# EasyEDA Pro project MP3426正负电源.eprj

# Schematic Schematic1
Board Name: Board1; Create Date: 2024-08-05; Page Name: P1; Project Name: MP3426正负电源; Schematic Name: Schematic1; Update Date: 2024-10-08; Company: 嘉立创EDA; Page Size: A4; Version: V1.0
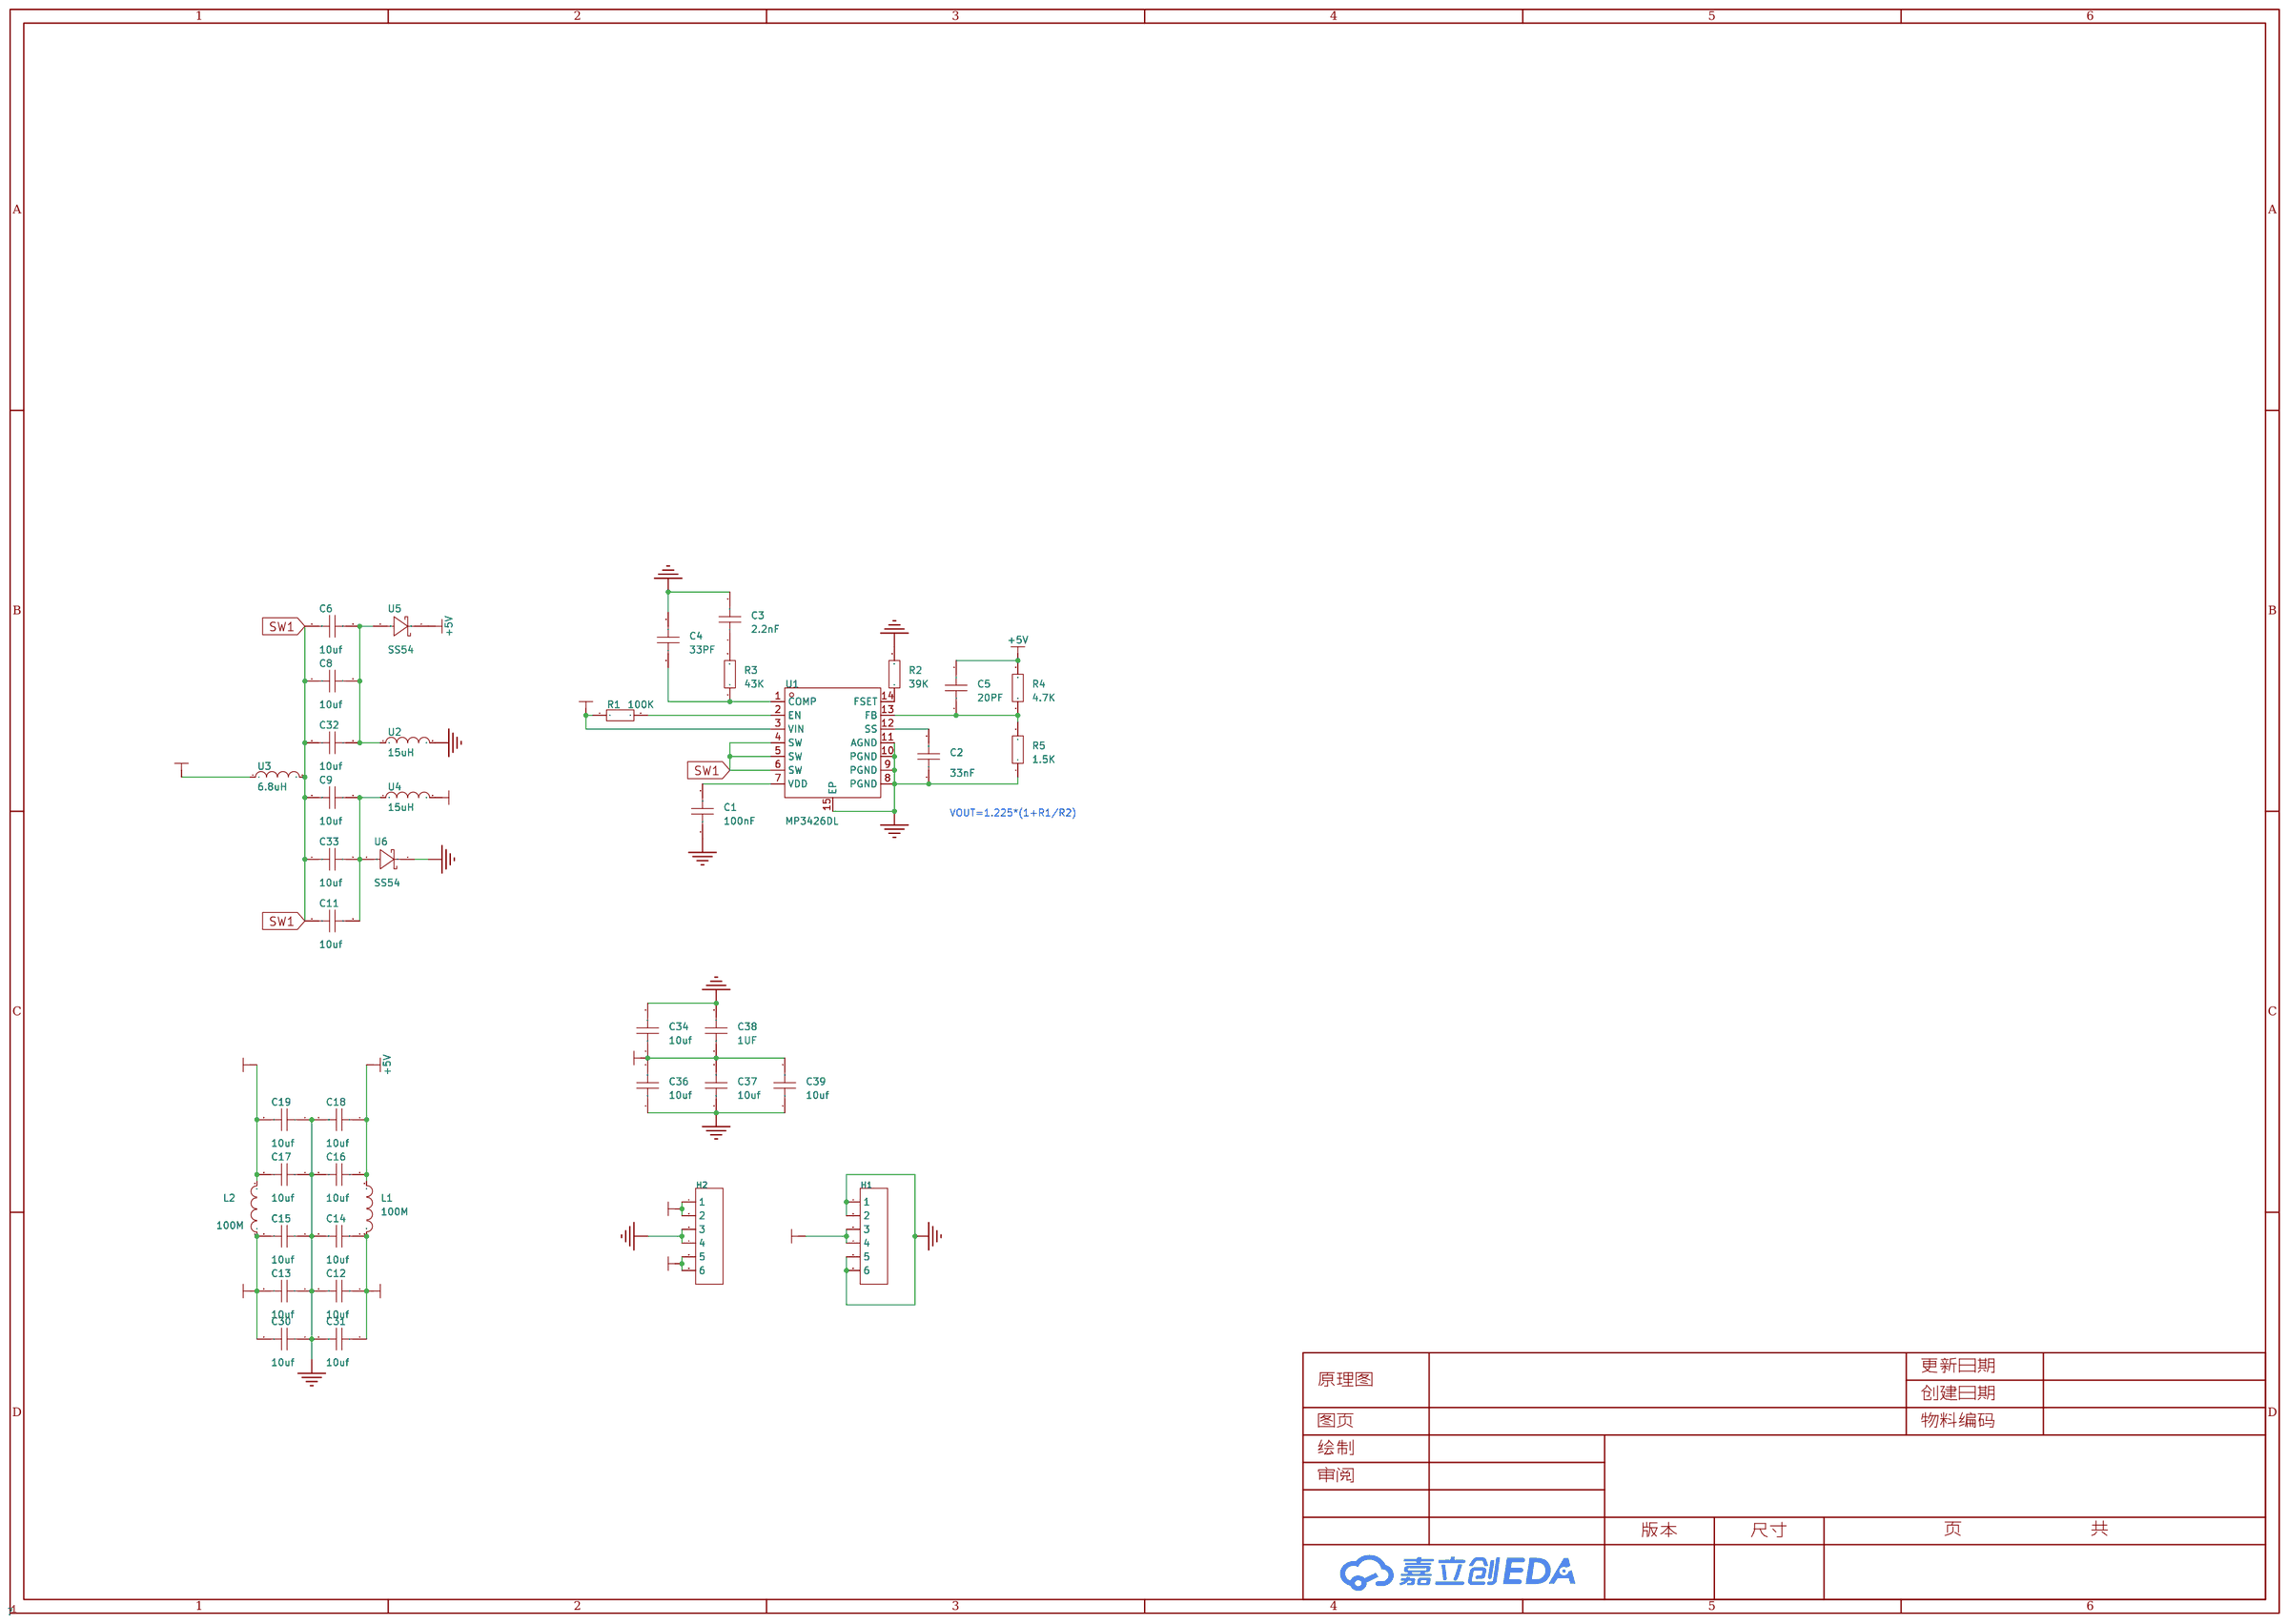
[diagram p0: schematic sheet]

## Parts
C1  100nF  [C0603]
C2  33nF  [C0603]
C3  2.2nF  [C0603]
C4  33PF  [C0603]
C5  20PF  [C0603]
C6  10uf  [C1206]
C8  10uf  [C1206]
C9  10uf  [C1206]
C11  10uf  [C1206]
C12  10uf  [C1206]
C13  10uf  [C1206]
C14  10uf  [C1206]
C15  10uf  [C1206]
C16  10uf  [C1206]
C17  10uf  [C1206]
C18  10uf  [C1206]
C19  10uf  [C1206]
C30  10uf  [C1206]
C31  10uf  [C1206]
C32  10uf  [C1206]
C33  10uf  [C1206]
C34  10uf  [C1206]
C36  10uf  [C1206]
C37  10uf  [C1206]
C38  1UF  [C0603]
C39  10uf  [C1206]
H1  -  [HDR-TH_6P-P2.54-V-M-1]
H2  -  [HDR-TH_6P-P2.54-V-M-1]
L1  100M  [L1206]
L2  100M  [L1206]
R1  100K  [R0603]
R2  39K  [R0603]
R3  43K  [R0603]
R4  4.7K  [R0603]
R5  1.5K  [R0603]
U1  MP3426DL  [DFN-14_L4.0-W3.0-P0.50-BL-EP]
U2  15uH  [IND-SMD_L7.1-W6.6-1]
U3  6.8uH  [IND-SMD_L11.0-W10.2]
U4  15uH  [IND-SMD_L7.1-W6.6-1]
U5  SS54  [SMB_L4.3-W3.6-LS5.4-RD]
U6  SS54  [SMB_L4.3-W3.6-LS5.4-RD]

## Library data of the parts
C1-C5 C38 = CAP_0603: Supplier Footprint: 0603
C6 C8 C9 C11-C19 C30-C34 C36 C37 C39 = CAP_1206: Supplier Footprint: 1206
H1 H2 = HDR-M_2.54_1x6P: Supplier Part: C37208; Supplier Footprint: 插件
L1 L2 = L_1206
R1-R5 = Res_0603: Supplier Footprint: 0603
U1 = MP3426DL: Supplier Part: C2909511; Supplier Footprint: QFN-14(3x4x0.5); JLCPCB Part Class: 扩展库; Supplier: LCSC
U2 U4 = CXP0650-4R7M-AG(4.7uh): 电感值:4.7uH;精度:±20%;额定电流:6A;饱和电流(Isat):8A;类型:一体成型电感;; LCSC Part Name: 4.7uH ±20% 8A; Supplier Part: C7461369; Manufacturer: DMBJ(振宝佳); Supplier Footprint: 0650; Datasheet: https://atta.szlcsc.com/upload/public/pdf/source/20230706/7F3A5B39C5AD80A91C9FA782B54A296B.pdf; Supplier: LCSC; Tolerance: ±20%; Rated Current: 6A; Saturation Current (Isat): 8A; DC Resistance (DCR): 34mΩ; Type: 一体成型电感
U3 = CXP1050-220M-AG(22uh): 电感值:22uH;精度:±20%;额定电流:5.5A;饱和电流(Isat):8A;类型:一体成型电感;; LCSC Part Name: 22uH ±20% 8A; Supplier Part: C7461393; Manufacturer: DMBJ(振宝佳); Supplier Footprint: 1050; JLCPCB Part Class: 扩展库; Datasheet: https://atta.szlcsc.com/upload/public/pdf/source/20230706/7F3A5B39C5AD80A91C9FA782B54A296B.pdf; Supplier: LCSC; Tolerance: ±20%; Rated Current: 5.5A; Saturation Current (Isat): 8A; DC Resistance (DCR): 48mΩ; Type: 一体成型电感
U5 U6 = SS54_C5200096: LCSC Part Name: IF:5A VR:40V VF:0.55V IFSM:150A; Supplier Part: C5200096; Manufacturer: HXY MOSFET(华轩阳电子); Supplier Footprint: SMB; JLCPCB Part Class: 扩展库; Datasheet: https://item.szlcsc.com/datasheet/SS54/5888311.html; Supplier: LCSC; Diode Configuration: 独立式; Voltage - Forward(Vf@If): 550mV@5A; Voltage - DC Reverse(Vr): 40V; Current - Rectified: 5A; Reverse Leakage Current (Ir): 500uA; Operating Junction Temperature Range: -55℃~+125℃; Non-Repetitive Peak Forward Surge Current: 150A

## Nets
+5V: C5.2 C16.1 C18.1 L1.1 R4.2 U5.1
+5VO: C12.1 C14.1 C31.1 H2.1 H2.2 L1.2
-5V: C17.2 C19.2 L2.2 U4.2
-5VO: C13.2 C15.2 C30.2 H2.5 H2.6 L2.1
GND: C1.1 C2.1 C3.2 C4.2 C12.2 C13.1 C14.2 C15.1 C16.2 C17.1 C18.2 C19.1 C30.1 C31.2 C34.2 C36.1 C37.1 C38.2 C39.1 H1.1 H1.2 H1.5 H1.6 H2.3 H2.4 R2.2 R5.1 U1.8(PGND) U1.9(PGND) U1.10(PGND) U1.11(AGND) U1.15(EP) U2.2 U6.1
VIN: C34.1 C36.2 C37.2 C38.1 C39.2 H1.3 H1.4 R1.1 U1.3(VIN) U3.1
SW1: C6.1 C8.1 C9.1 C11.1 C32.1 C33.1 U1.4(SW) U1.5(SW) U1.6(SW) U3.2
$1N199: R1.2 U1.2(EN)
$1N309: C1.2 U1.7(VDD)
$1N386: R2.1 U1.14(FSET)
$1N504: C2.2 U1.12(SS)
$1N559: C3.1 R3.2
$1N619: C4.1 R3.1 U1.1(COMP)
$1N703: C5.1 R4.1 R5.2 U1.13(FB)
$1N1052: C9.2 C11.2 C33.2 U4.1 U6.2
$1N1057: C6.2 C8.2 C32.2 U2.1 U5.2

## Notes on the sheet
- VOUT=1.225*(1+R1/R2)

# Board PCB1
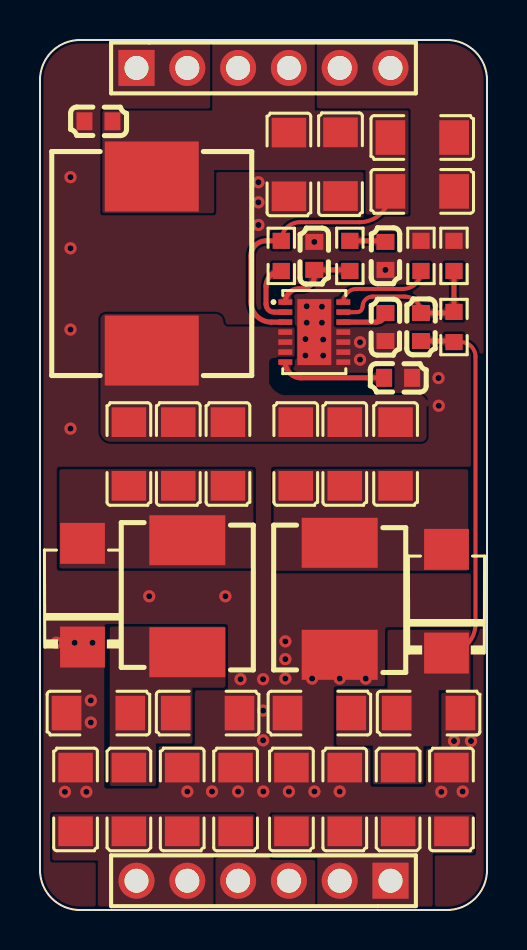
[diagram p1: board, top side]
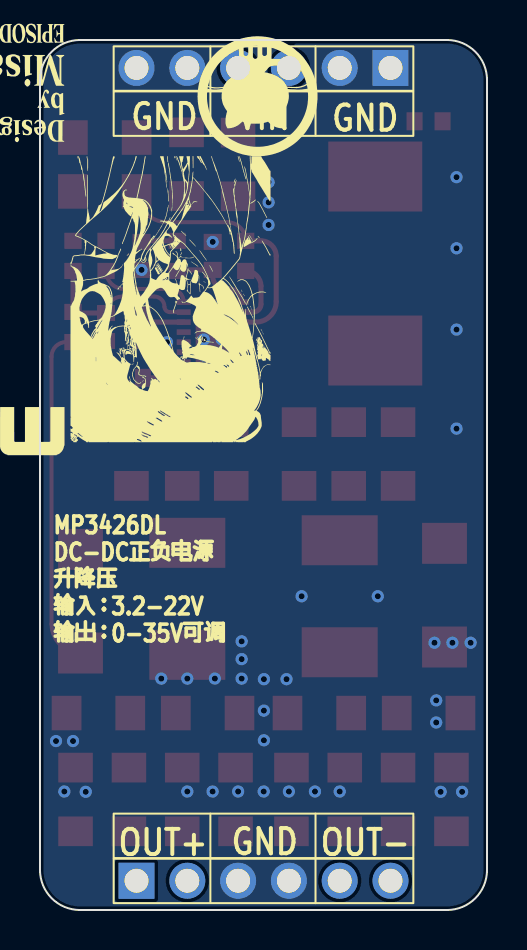
[diagram p2: board, bottom side, seen from below]

Outline 22.35 x 43.5 mm; copper layers: Top Layer, Bottom Layer. Coordinates in mm from the lower left corner of the outline.
Outline path: 0,41.5 0,2 arc(0.59,0.59) 2,0 20.35,0 arc(21.77,0.59) 22.35,2 22.35,41.5 arc(21.77,42.91) 20.35,43.5 2,43.5 arc(0.59,42.91) 0,41.5
Stack: Top Layer 0.035mm / Dielectric1 1.51mm FR4 er 4.5 / Bottom Layer 0.035mm

## Design rules (mm)
template: 自定义配置
spacing copperThickness1oz (default): track to track 0.102, other pairs 0.152 to 0.3
spacing copperThickness2oz: track to track 0.203, other pairs 0.152 to 0.3
track width copperThickness1oz (default): min 0.127, default 0.254, max 2.54
track width copperThickness2oz: min 0.203, default 0.254, max 2.54
differential pair differentialPair (default): width min 0.127, default 0.254, max 2.54; gap min 0.152, default 0.152
via viaSize (default): diameter min 0.5, default 0.61, max 10; hole min 0.3, default 0.305, max 6.3

## Placement (name value [footprint] x y rotation side)
C1  100nF  [C0603]  17.91 26.61 180 top
C2  33nF  [C0603]  17.27 29.15 90 top
C3  2.2nF  [C0603]  17.27 32.7 270 top
C4  33PF  [C0603]  13.72 32.7 90 top
C5  20PF  [C0603]  19.05 29.15 270 top
C6  10uf  [C1206]  15.24 22.8 270 top
C8  10uf  [C1206]  12.79 22.8 270 top
C9  10uf  [C1206]  6.92 22.8 270 top
C11  10uf  [C1206]  4.44 22.8 270 top
C12  10uf  [C1206]  15.24 5.53 90 top
C13  10uf  [C1206]  1.78 5.53 270 top
C14  10uf  [C1206]  20.57 5.53 90 top
C15  10uf  [C1206]  7.11 5.53 270 top
C16  10uf  [C1206]  13.97 9.84 180 top
C17  10uf  [C1206]  2.92 9.84 0 top
C18  10uf  [C1206]  19.43 9.84 0 top
C19  10uf  [C1206]  8.38 9.84 180 top
C30  10uf  [C1206]  9.78 5.53 270 top
C31  10uf  [C1206]  12.57 5.53 90 top
C32  10uf  [C1206]  17.78 22.8 270 top
C33  10uf  [C1206]  9.4 22.8 270 top
C34  10uf  [C1206]  19.11 38.62 0 top
C36  10uf  [C1206]  19.11 35.93 180 top
C37  10uf  [C1206]  12.45 37.28 90 top
C38  1UF  [C0603]  2.92 39.44 180 top
C39  10uf  [C1206]  15.03 37.29 90 top
H1  -  [HDR-TH_6P-P2.54-V-M-1]  11.18 42.1 0 top
H2  -  [HDR-TH_6P-P2.54-V-M-1]  11.18 1.46 180 top
L1  100M  [L1206]  17.91 5.53 270 top
L2  100M  [L1206]  4.44 5.53 90 top
R1  100K  [R0603]  12.06 32.7 270 top
R2  39K  [R0603]  19.05 32.7 90 top
R3  43K  [R0603]  15.49 32.7 90 top
R4  4.7K  [R0603]  20.7 29.15 270 top
R5  1.5K  [R0603]  20.7 32.7 270 top
U1  MP3426DL  [DFN-14_L4.0-W3.0-P0.50-BL-EP]  13.72 28.89 270 top
U2  15uH  [IND-SMD_L7.1-W6.6-1]  14.99 15.56 270 top
U3  6.8uH  [IND-SMD_L11.0-W10.2]  5.59 32.32 270 top
U4  15uH  [IND-SMD_L7.1-W6.6-1]  7.37 15.69 270 top
U5  SS54  [SMB_L4.3-W3.6-LS5.4-RD]  20.33 15.44 90 top
U6  SS54  [SMB_L4.3-W3.6-LS5.4-RD]  2.13 15.74 90 top

## Footprints (pads in the part's own frame, mm; a bottom-side part is the same pattern mirrored in y, then rotated)
C0603
  rect 0.8x0.9 smd: 1(-0.7,0) 2(0.7,0)
C1206
  rect 1.485x1.728 smd: 1(-1.593,0) 2(1.593,0)
DFN-14_L4.0-W3.0-P0.50-BL-EP
  rect 0.28x0.7 smd: 1(-1.5,-1.45) 2(-1,-1.45) 3(-0.5,-1.45) 4(0,-1.45) 5(0.5,-1.45) 6(1,-1.45) 7(1.5,-1.45) 8(1.5,1.45) 9(1,1.45) 10(0.5,1.45) 11(0,1.45) 12(-0.5,1.45) 13(-1,1.45) 14(-1.5,1.45)
  rect 3.3x1.7 smd: 15(0,0)
HDR-TH_6P-P2.54-V-M-1
  rect 1.8x1.8 hole 1.2: 1(-6.35,0)
  round 1.8 hole 1.2: 2(-3.81,0) 3(-1.27,0) 4(1.27,0) 5(3.81,0) 6(6.35,0)
IND-SMD_L7.1-W6.6-1
  rect 2.5x3.8 smd: 1(-2.8,0) 2(2.8,0)
IND-SMD_L11.0-W10.2
  rect 3.5x4.7 smd: 1(-4.35,0) 2(4.35,0)
L1206
  rect 1.485x1.728 smd: 1(-1.593,0) 2(1.593,0)
R0603
  rect 0.806x0.864 smd: 1(-0.753,0) 2(0.753,0)
SMB_L4.3-W3.6-LS5.4-RD
  rect 2.047x2.241 smd: 1(-2.591,0) 2(2.591,0)

## Nets
As in the schematic.

## Via types
v1: diameter 0.61, hole 0.304, Top Layer to Bottom Layer, 8 vias
v2: diameter 0.61, hole 0.305, Top Layer to Bottom Layer, 43 vias

## Routing (per net, layer and track width the routed paths; a pad name or vN(x,y) marks a point on that pad's centre or on a via; arc(x,y) is an arc through that point)
+5V: length 18.8
  Top Layer w0.2: R4.2 21.05,28.4 arc(21.56,28.18) 21.78,27.67 21.78,14.3 arc(21.35,13.27) U5.1
  Top Layer w0.254: C5.2 20.65,28.45 arc(20.69,28.43) R4.2
GND:
  vias: v1(1.52,36.64) v1(1.52,33.09) v1(1.52,29.02) v1(1.52,24.07) v1(5.46,15.69) v1(9.27,15.69) v1(12.27,11.57) v1(20.07,5.91) v2(0.82,13.36) v2(1.25,5.91) v2(1.73,13.36) v2(2.32,5.91) v2(2.54,10.48) v2(2.54,9.38) v2(2.63,13.36) v2(7.37,5.92) v2(8.6,5.92) v2(9.91,5.92) v2(10.03,11.54) v2(10.92,36.39) v2(10.92,35.38) v2(10.92,34.25) v2(11.16,11.54) v2(11.16,9.97) v2(11.16,8.48) v2(11.17,5.92) v2(12.27,13.43) v2(12.27,12.54) v2(12.45,5.92) v2(13.27,28.54) v2(13.27,27.72) v2(13.33,30.19) v2(13.33,29.37) v2(13.61,11.57) v2(13.72,33.41) v2(13.72,5.92) v2(14.1,30.16) v2(14.1,29.36) v2(14.16,28.52) v2(14.16,27.72) v2(14.99,11.57) v2(14.99,5.92) v2(16,28.39) v2(16,27.52) v2(16.29,11.57) v2(17.27,32) v2(19.93,26.6) v2(19.94,25.21) v2(20.7,8.45) v2(21.13,5.92) v2(21.55,8.45)
VIN: length 13.4
  Top Layer w0.2: C36.2 arc(17.07,34.84) 15.98,34.39 13,34.39 arc(12.34,34.12) R1.1
  Top Layer w0.254: U1.3 11.56,29.39 arc(10.84,29.69) 10.54,30.42 10.54,32.7 arc(10.76,33.24) 11.3,33.46 R1.1
$1N199: length 3.3
  Top Layer w0.254: U1.2 11.7,29.89 arc(11.42,30.01) 11.3,30.29 11.3,31.19 arc(11.53,31.73) R1.2
$1N309: length 5.4
  Top Layer w0.254: C1.2 13.05,26.61 arc(12.5,26.84) U1.7
$1N386: length 4.8
  Top Layer w0.2: R2.1 arc(18.79,31.32) 18.15,31.05 15.82,31.05 arc(15.36,30.86) U1.14
$1N504: length 2.4
  Top Layer w0.254: U1.12 16.82,29.39 arc(17.14,29.53) C2.2
$1N559: length 1.8
  Top Layer w0.254: C3.1 17.22,33.46 R3.2
$1N619: length 4.3
  Top Layer w0.254: R3.1 15.44,32 C4.1 13.72,31.69 arc(13.53,31.24) 13.08,31.05 12.92,31.05 arc(12.46,30.86) U1.1
$1N703: length 8.5
  Top Layer w0.2: U1.13 15.86,29.89 arc(16.05,29.97) 16.13,30.16 arc(16.28,30.52) 16.64,30.67 18.23,30.67 arc(18.81,30.43) C5.1
  Top Layer w0.254: R5.2 R4.1 arc(20.69,29.86) 20.65,29.85 C5.1

## Copper pours and planes (outline as drawn; the poured copper is in the pictures)
+5V on Top Layer: 17.38,14.01 17.38,11.06 14.81,11.06 14.81,8.22 16.64,8.22 16.64,6.29 19.17,6.29 19.17,8.19 19.94,8.19 19.94,10.99 21.53,10.99 21.53,14.01
+5VO on Top Layer: 11.6,4.75 11.6,2.63 13.89,2.63 13.89,0.19 19.61,0.19 19.61,2.86 21.67,2.86 21.67,4.75
-5V on Top Layer: 3.49,14.17 3.49,6.2 5.8,6.2 5.8,8.32 7.62,8.32 7.62,11.11 9.27,11.11 9.27,14.17
-5VO on Top Layer: 0.63,4.77 0.63,2.5 2.92,2.5 2.92,0.19 8.64,0.19 8.64,2.73 10.7,2.73 10.7,4.75 10.69,4.77
GND on Top Layer: -1.4,44.26 23.24,44.26 23.24,-0.95 -1.4,-0.95
GND on Bottom Layer: -2.41,45.15 23.75,45.15 23.75,-2.09 -2.41,-2.09
VIN on Top Layer: 8.64,43.75 8.64,39.94 3.14,39.94 3.14,34.86 8.68,34.86 8.68,37.02 16.3,37.02 16.3,34.8 18.4,34.8 18.4,39.95 13.72,39.95 13.72,43.75
$1N1052 on Top Layer: 0.97,22.04 10.67,22.04 10.67,17.08 0.97,17.08
$1N1057 on Top Layer: 11.68,22.04 21.41,22.04 21.41,16.96 11.68,16.96
SW1 on Top Layer: 12.71,29.14 12.7,29.15 9.4,29.15 9.22,29.22 9.03,29.67 8.76,29.78 3.3,29.78 3.12,29.71 3.05,29.53 3.05,23.94 3.2,23.58 3.56,23.43 19.05,23.43 19.23,23.51 19.3,23.69 19.3,25.34 19.24,25.57 19.05,25.72 12.19,25.72 11.73,25.94 11.43,26.36 11.43,27.37 11.5,27.55 11.68,27.63 12.71,27.63

Small or netless copper shapes (teardrops, artwork), in the pictures only: 22 on Top Layer

## Text on the board
Bottom Silkscreen Layer: GND | OUT- | VIN | OUT+ | MP3426DL / DC-DC正负电源 / 升降压 / 输入：3.2-22V / 输出：0-35V可调
